# Altium schematic sheet USB_UART.SchDoc
size A4
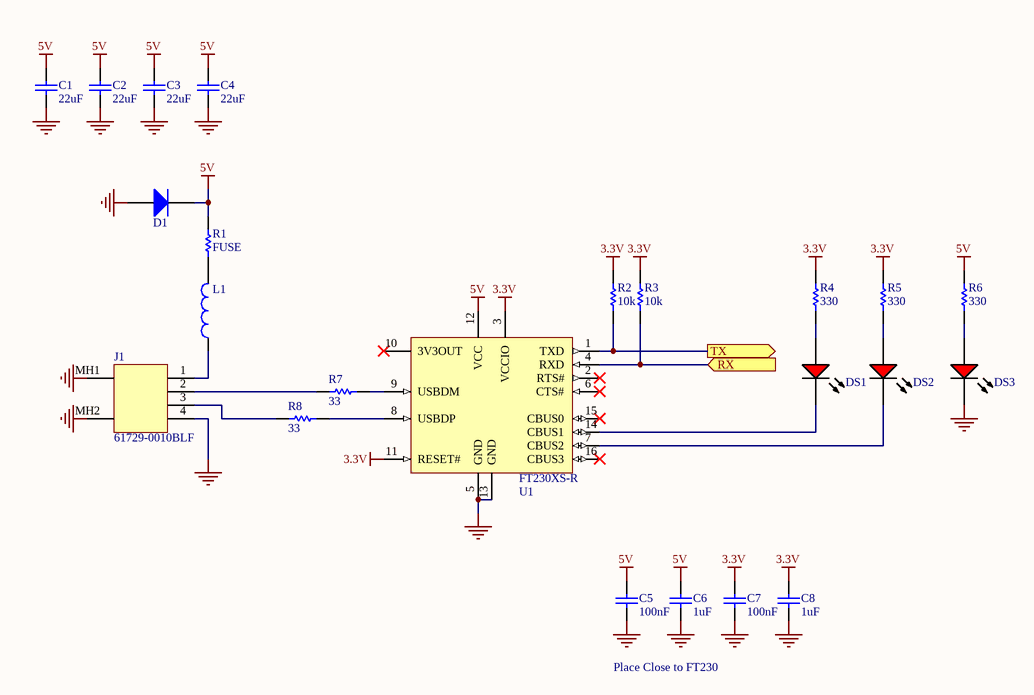
[diagram p0: USB_UART.SchDoc]

## Parts
C1  22uF  [CAPC1206(3216)190_M]
C2  22uF  [CAPC1206(3216)190_M]
C3  22uF  [CAPC1206(3216)190_M]
C4  22uF  [CAPC1206(3216)190_M]
C5  100nF  [CAPC0805(2012)145_N]
C6  1uF  [CAPC0805(2012)145_N]
C7  100nF  [CAPC0805(2012)145_N]
C8  1uF  [CAPC0805(2012)145_N]
D1  MMSD4148T3G  [ONSC-SOD123-2-425G-04_V]  (value not drawn)
DS1  TLMS1100-GS08  [VISH-TLMX1100_V]  (value not drawn)
DS2  TLMS1100-GS08  [VISH-TLMX1100_V]  (value not drawn)
DS3  TLMS1100-GS08  [VISH-TLMX1100_V]  (value not drawn)
J1  61729-0010BLF  [FCI-61729-0010BLF-6_V]
L1  FBMJ2125HM210NT  [INDC2013X105X50LL20T30]  (value not drawn)
R1  FUSE  [RESC0805(2012)_M]
R2  10k  [RESC0805(2012)_M]
R3  10k  [RESC0805(2012)_M]
R4  330  [RESC0805(2012)_M]
R5  330  [RESC0805(2012)_M]
R6  330  [RESC0805(2012)_M]
R7  33  [RESC0805(2012)_M]
R8  33  [RESC0805(2012)_M]
U1  FT230XS-R  [SSOP-16_M]

## Ports
RX (in), TX (out)

## Nets
3.3V: C7.2 C8.2 R2.2 R3.2 R4.2 R5.2 U1.3(VCCIO) U1.11(RESET#)
5V: C1.2 C2.2 C3.2 C4.2 C5.2 C6.2 D1.1(CATHODE) R1.2 R6.2 U1.12(VCC)
GND: C1.1 C2.1 C3.1 C4.1 C5.1 C6.1 C7.1 C8.1 D1.2(ANODE) DS3.2(K) J1.4 J1.MH1 J1.MH2 U1.5(GND) U1.13(GND)
RX: R3.1 U1.4(RXD) ; port RX
TX: R2.1 U1.1(TXD) ; port TX
NetDS1_1: DS1.1(A) R4.1
NetDS1_2: DS1.2(K) U1.14(CBUS1)
NetDS2_1: DS2.1(A) R5.1
NetDS2_2: DS2.2(K) U1.7(CBUS2)
NetDS3_1: DS3.1(A) R6.1
NetJ1_1: J1.1 L1.1
NetJ1_2: J1.2 R7.1
NetJ1_3: J1.3 R8.1
NetL1_2: L1.2 R1.1
NetR7_2: R7.2 U1.9(USBDM)
NetR8_2: R8.2 U1.8(USBDP)

Not connected (* = marked no-connect by the designer): U1 2(RTS#)* 6(CTS#)* 10(3V3OUT)* 15(CBUS0)* 16(CBUS3)*

## Notes on the sheet
- Place Close to FT230

## Library data of the parts
C1-C4 = CMP-1037-04993-1: Tolerance: Â±20%; Rated Voltage: 16 V; Case-Metric: 3216; Case-EIA: 1206; Value: 22uF; Technology: SMT; Max Thickness: 1.9 mm
C5 C7 = CMP-1036-04431-1: Case-Metric: 2012; Rated Voltage: 100 V; Tolerance: Â±20%; Case-EIA: 0805; Value: 100nF; Technology: SMT; Max Thickness: 1.45 mm
C6 C8 = CMP-1036-04431-1: Case-Metric: 2012; Value: 100nF; Rated Voltage: 100 V; Tolerance: Â±20%; Case-EIA: 0805; Technology: SMT; Max Thickness: 1.45 mm
D1 = CMP-0895-00002-1: Manufacturer: ON Semiconductor; CD (Max): 4 pF; IR @ VR: 75 V (Max)=50 uA; PD (Max): 425 mW; VF (Max): 1 A; Trr (Max): 4 ns; Packing: Tape and Reel; VBR (Min): 100 V; ComponentLink1URL: http://www.onsemi.com/; ComponentLink1Description: Manufacturer URL; PackageReference: SOD123-2-425G-04; PackageDescription: 2-Pin SOD123, Body 2.69 x 1.6 mm, Height 1.35 mm; ComponentLink2Description: Datasheet; Mounting Technology: Surface Mount; RoHS: TRUE; PartNumber: MMSD4148T3G; PackageVersion: Rev. 04G; DatasheetVersion: Rev. 11; Temperature Range: -55 to 150 degC; ComponentLink3Description: Package Specification; ComponentLink3URL: http://www.onsemi.com/pub_link/Collateral/425-04.PDF; ComponentLink2URL: http://www.onsemi.com/pub_link/Collateral/MMSD4148T1-D.PDF
DS1-DS3 = CMP-1666-00027-1: LED, RED, 2.1 V, -40 to 100 degC, 2-Pin SMD (0603), RoHS, Tape and Reel; Type (Capacitors): C0G; Resistance: 100000000000 Ohm; Capacitance: 12 pF; Voltage Rating: 50 V; Tolerance: 5%; Min Operating Temperature: -55degC; REACH SVHC: No SVHC; ComponentLink2Description: Datasheet; ComponentLink1URL: http://www.vishay.com/; Width: 0.8 mm; Package Quantity: 4000; PackageReference: TLMX1100; ComponentLink2URL: http://www.vishay.com/docs/83173/tlmb1100.pdf; Case/Package: 0603; Case Code (Metric): 1608; Packaging: Tape and Reel; Pins: 2; ComponentLink1Description: Manufacturer URL; Max Operating Temperature: 125degC; Height: 0.8 mm; Length: 1.6 mm; Mount: Surface Mount; PackageDescription: 2-Pin Surface Mount Device, Body 1.6 x 0.8 mm; DatasheetVersion: Rev. 2.7, 03/2016; Case Code (Imperial): 0603; Voltage Rating (DC): 50 V; RoHSCompliant: True; Radiation Hardening: No
J1 = CMP-0397-00002-2: Single USB 2.0, B Type, Right Angle Jack, Through Hole, RoHS, Tube; Manufacturer: FCI Electronics; Number of Contacts: 4; Gender: Receptacle; Specifications: USB 2.0; Connector Type: USB-B; ComponentLink1URL: http://portal.fciconnect.com/; DatasheetVersion: Rev. V; PartNumber: 61729-0010BLF; ComponentLink3Description: Package Specification; PackageDescription: 6-Pin, Through Hole, Body 12.2 x 16 mm; Packing: Tube; ComponentLink2Description: Datasheet; Mounting Technology: Through Hole; PackageReference: 61729-0010BLF; ComponentLink1Description: Manufacturer URL; ComponentLink3URL: http://portal.fciconnect.com/Comergent//fci/drawing/61729.pdf; ComponentLink2URL: http://portal.fciconnect.com/Comergent//fci/drawing/61729.pdf; RoHS: TRUE
L1 = CMP-1660-00003-1: Chip Inductor, 21 Ohm, +/- 30%, 6 A, -40 to 125 degC, 0805 (2012 Metric), RoHS, Tape and Reel; Core Material: Ferrite; Current Rating: 6 A; Resistance: 4 mohm; Case\Package: 0805; Impedance: 21 Ohm; Min Operating Temperature: -40 degC; Width: 1.25 mm; PackageDescription: 2-Pin Surface Mount Device, Body 2 x 1.25 mm; Mounting Technology: Surface Mount; Package Quantity: 1; DatasheetVersion: 08/2016; Tolerance: 30%; Mount: Surface Mount; Max Operating Temperature: 125 degC; Height: 0.85 mm; ComponentLink1URL: http://www.t-yuden.com/; Case Code (Metric): 2012; ComponentLink1Description: Manufacturer URL; ComponentLink2URL: http://ds.yuden.co.jp/TYCOMPAS/ut/detail.do?productNo=FBMJ2125HM210NT&fileName=FBMJ2125HM210NT_SS&mode=specSheetDownload; Case Code (Imperial): 0805; Packaging: Tape and Reel; ComponentLink2Description: Datasheet; PackageReference: 0805; RoHSCompliant: true; Max Current Rating: 6 A; Length: 2 mm; REACH SVHC: Unknown
R1-R8 = CMP-1013-00038-1: Power: 0.125 W; Case-Metric: 2012; Case-EIA: 0805; Tolerance: 5 %; Value: 33.00 Ohm; Technology: SMT
U1 = CMP-0248-00026-2: USB to Basic UART Interface Chip, UHCI/OHCI/EHCI Compatible, USB 2.0 Compatible, -40 to +85 degC, 16-Pin SSOP, Pb-Free, Tape and Reel; Manufacturer: FTDI; DatasheetVersion: ver 1.2, Feb-2013; PackageDescription: 16-Pin Small Outline Package, 8.6 x 3.9 mm Body, 0.635 mm Pitch; ComponentLink1Description: Manufacturer URL; ComponentLink2Description: Datasheet; ComponentLink2URL: http://www.ftdichip.com/Support/Documents/DataSheets/ICs/DS_FT230X.pdf; ComponentLink3URL: www.ftdichip.com/Products/ICs/FT230X.html; ComponentLink3Description: FT230X Product Page; PackageReference: SSOP-16; ComponentLink1URL: http://www.ftdichip.com/; PartNumber: FT230XS-R; RevisionNote: DatasheetVersion updated to 1.2 Feb-2013; Code_JEDEC: MO-137-AB; PackageVersion: Feb-13